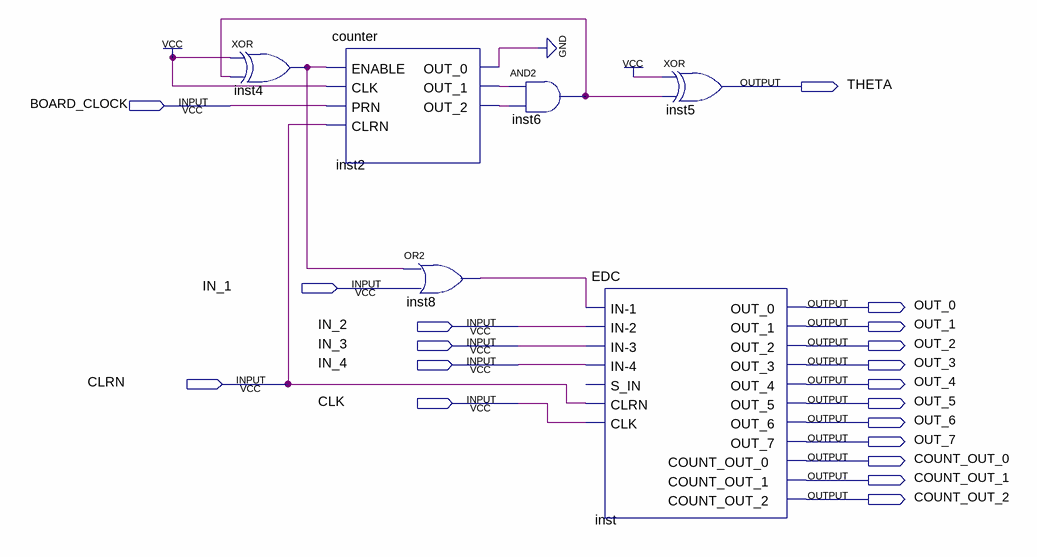
[diagram p0: schematic sheet]
// Quartus schematic edit_store.bdf as structural Verilog: 6 symbols, 19 pins
module edit_store (
  input  BOARD_CLOCK,
  input  IN_1,
  input  IN_2,
  input  IN_3,
  input  IN_4,
  input  CLRN,
  input  CLK,
  output THETA,
  output OUT_0,
  output OUT_1,
  output OUT_2,
  output OUT_3,
  output OUT_4,
  output OUT_5,
  output OUT_6,
  output OUT_7,
  output COUNT_OUT_0,
  output COUNT_OUT_1,
  output COUNT_OUT_2
);

  wire inst2_out_0, inst2_out_1, inst2_out_2, inst4_out, inst6_out, inst8_out;

  xor inst4 (inst4_out, 1'b1, inst6_out);
  counter inst2 (
    .ENABLE(inst4_out), .PRN(BOARD_CLOCK), .CLK(1'b1), .CLRN(CLRN), .OUT_0(inst2_out_0), .OUT_1(inst2_out_1),
    .OUT_2(inst2_out_2));
  or inst8 (inst8_out, inst4_out, IN_1);
  and inst6 (inst6_out, inst2_out_1, inst2_out_2);
  EDC inst (
    .\IN-1 (inst8_out), .\IN-2 (IN_2), .\IN-3 (IN_3), .\IN-4 (IN_4), .CLRN(CLRN), .CLK(CLK), .OUT_0(OUT_0),
    .OUT_1(OUT_1), .OUT_2(OUT_2), .OUT_3(OUT_3), .OUT_4(OUT_4), .OUT_5(OUT_5), .OUT_6(OUT_6), .OUT_7(OUT_7),
    .COUNT_OUT_0(COUNT_OUT_0), .COUNT_OUT_1(COUNT_OUT_1), .COUNT_OUT_2(COUNT_OUT_2));  // open: S_IN
  xor inst5 (THETA, 1'b1, inst6_out);
  // also tied to GND on the sheet: inst2_out_0
endmodule
